# Altium schematic sheet Models.SchDoc
size A3
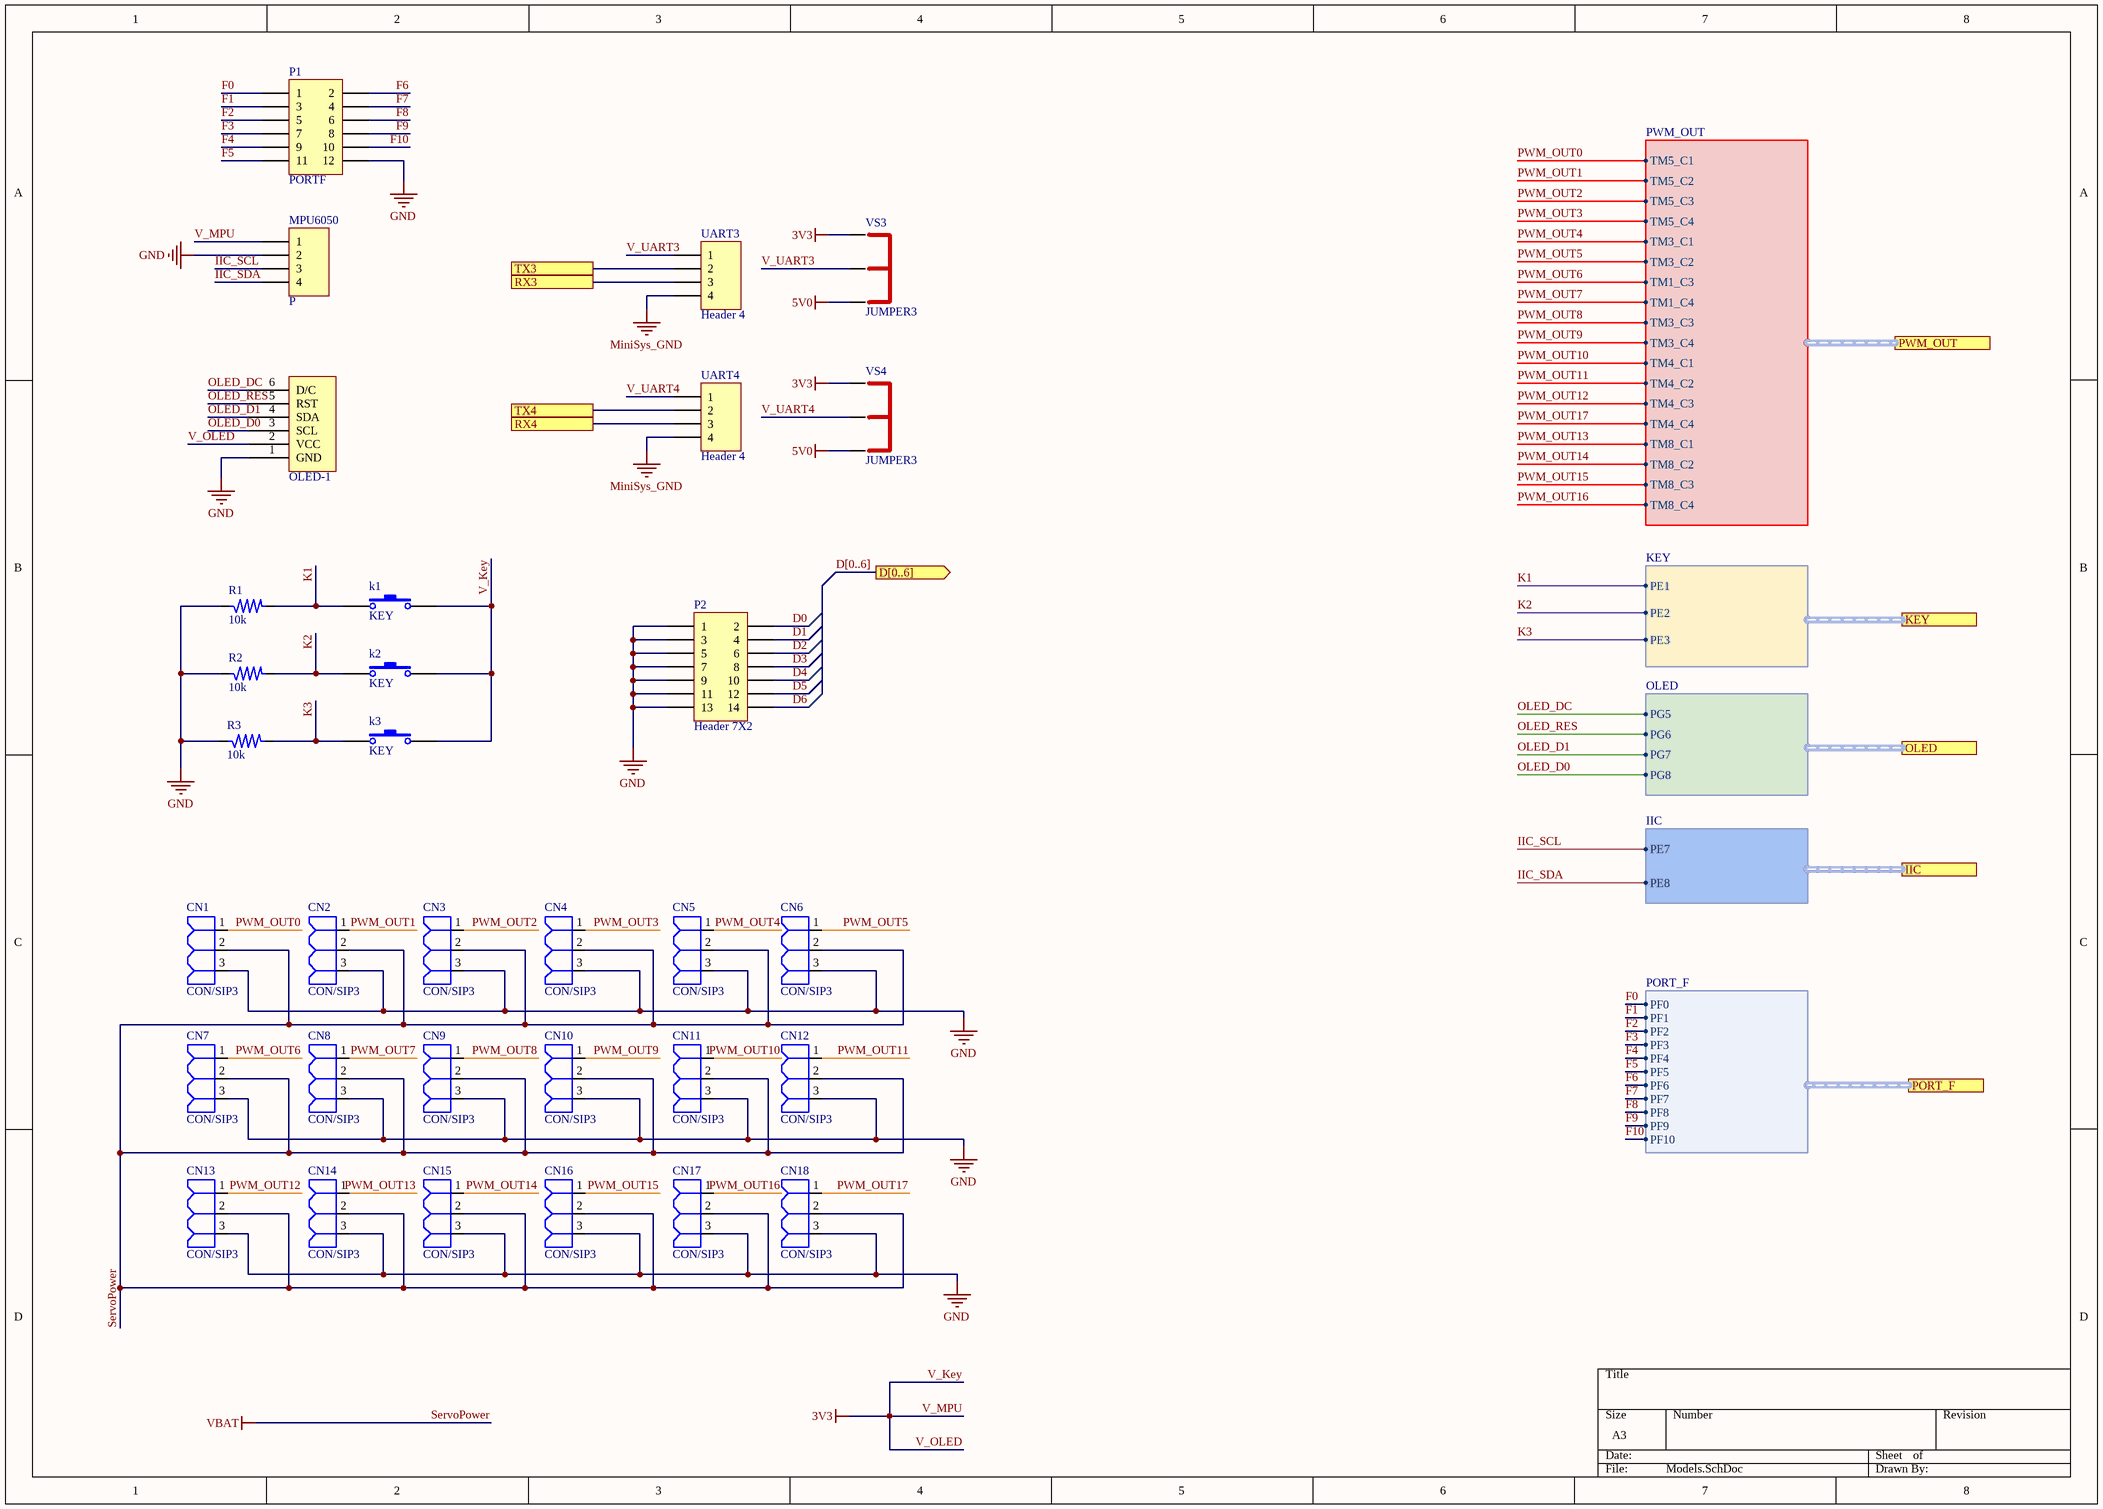
[diagram p0: Models.SchDoc]

## Parts
CN1  CON/SIP3  [HDR1X3]
CN2  CON/SIP3  [HDR1X3]
CN3  CON/SIP3  [HDR1X3]
CN4  CON/SIP3  [HDR1X3]
CN5  CON/SIP3  [HDR1X3]
CN6  CON/SIP3  [HDR1X3]
CN7  CON/SIP3  [HDR1X3]
CN8  CON/SIP3  [HDR1X3]
CN9  CON/SIP3  [HDR1X3]
CN10  CON/SIP3  [HDR1X3]
CN11  CON/SIP3  [HDR1X3]
CN12  CON/SIP3  [HDR1X3]
CN13  CON/SIP3  [HDR1X3]
CN14  CON/SIP3  [HDR1X3]
CN15  CON/SIP3  [HDR1X3]
CN16  CON/SIP3  [HDR1X3]
CN17  CON/SIP3  [HDR1X3]
CN18  CON/SIP3  [HDR1X3]
k1  KEY  [按键-贴片-1]
k2  KEY  [按键-贴片-1]
k3  KEY  [按键-贴片-1]
MPU6050  P  [HDR1X4]
OLED-1  OLED直插  [OLED直插]  (value not drawn)
P1  PORTF  [HDR2X6]
P2  Header 7X2  [HDR2X7]
R1  10k  [R0805]
R2  10k  [R0805]
R3  10k  [R0805]
UART3  Header 4  [HDR1X4]
UART4  Header 4  [HDR1X4]
VS3  JUMPER3  [Jumper3]
VS4  JUMPER3  [Jumper3]

## Ports
D[0..6] (out), IIC (harness IIC), KEY (harness KEY), OLED (harness OLED), PORT_F (harness PORT_F), PWM_OUT (harness PWM_OUT), RX3, RX4, TX3, TX4

## Harnesses
PWM_OUT: TM5_C1, TM5_C2, TM5_C3, TM5_C4, TM3_C1, TM3_C2, TM1_C3, TM1_C4, TM3_C3, TM3_C4, TM4_C1, TM4_C2, TM4_C3, TM8_C1, TM8_C2, TM8_C3, TM8_C4, TM4_C4
KEY: PE1, PE2, PE3
OLED: PG5, PG6, PG7, PG8
IIC: PE7, PE8
PORT_F: PF0, PF1, PF2, PF3, PF4, PF5, PF6, PF7, PF8, PF9, PF10

## Nets
5V0: VS3.3 VS4.3
GND: CN1.3 CN2.3 CN3.3 CN4.3 CN5.3 CN6.3 CN7.3 CN8.3 CN9.3 CN10.3 CN11.3 CN12.3 CN13.3 CN14.3 CN15.3 CN16.3 CN17.3 CN18.3 MPU6050.2 OLED-1.1(GND) P1.12 P2.1 P2.3 P2.5 P2.7 P2.9 P2.11 P2.13 R1.2 R2.2 R3.2
MiniSys_GND: UART3.4 UART4.4
ServoPower: CN1.2 CN2.2 CN3.2 CN4.2 CN5.2 CN6.2 CN7.2 CN8.2 CN9.2 CN10.2 CN11.2 CN12.2 CN13.2 CN14.2 CN15.2 CN16.2 CN17.2 CN18.2  [also labelled VBAT]
V_Key: k1.2 k2.2 k3.2 MPU6050.1 OLED-1.2(VCC) VS3.1 VS4.1  [also labelled 3V3, V_MPU, V_OLED]
D0: P2.2
D1: P2.4
D2: P2.6
D3: P2.8
D4: P2.10
D5: P2.12
D6: P2.14
F0: P1.1 ; port PORT_F.PF0
F1: P1.3 ; port PORT_F.PF1
F2: P1.5 ; port PORT_F.PF2
F3: P1.7 ; port PORT_F.PF3
F4: P1.9 ; port PORT_F.PF4
F5: P1.11 ; port PORT_F.PF5
F6: P1.2 ; port PORT_F.PF6
F7: P1.4 ; port PORT_F.PF7
F8: P1.6 ; port PORT_F.PF8
F9: P1.8 ; port PORT_F.PF9
F10: P1.10 ; port PORT_F.PF10
IIC_SCL: MPU6050.3 ; port IIC.PE7
IIC_SDA: MPU6050.4 ; port IIC.PE8
K1: k1.1 R1.1 ; port KEY.PE1
K2: k2.1 R2.1 ; port KEY.PE2
K3: k3.1 R3.1 ; port KEY.PE3
OLED_D0: OLED-1.3(SCL) ; port OLED.PG8
OLED_D1: OLED-1.4(SDA) ; port OLED.PG7
OLED_DC: OLED-1.6(D/C) ; port OLED.PG5
OLED_RES: OLED-1.5(RST) ; port OLED.PG6
PWM_OUT0: CN1.1 ; port PWM_OUT.TM5_C1
PWM_OUT1: CN2.1 ; port PWM_OUT.TM5_C2
PWM_OUT2: CN3.1 ; port PWM_OUT.TM5_C3
PWM_OUT3: CN4.1 ; port PWM_OUT.TM5_C4
PWM_OUT4: CN5.1 ; port PWM_OUT.TM3_C1
PWM_OUT5: CN6.1 ; port PWM_OUT.TM3_C2
PWM_OUT6: CN7.1 ; port PWM_OUT.TM1_C3
PWM_OUT7: CN8.1 ; port PWM_OUT.TM1_C4
PWM_OUT8: CN9.1 ; port PWM_OUT.TM3_C3
PWM_OUT9: CN10.1 ; port PWM_OUT.TM3_C4
PWM_OUT10: CN11.1 ; port PWM_OUT.TM4_C1
PWM_OUT11: CN12.1 ; port PWM_OUT.TM4_C2
PWM_OUT12: CN13.1 ; port PWM_OUT.TM4_C3
PWM_OUT13: CN14.1 ; port PWM_OUT.TM8_C1
PWM_OUT14: CN15.1 ; port PWM_OUT.TM8_C2
PWM_OUT15: CN16.1 ; port PWM_OUT.TM8_C3
PWM_OUT16: CN17.1 ; port PWM_OUT.TM8_C4
PWM_OUT17: CN18.1 ; port PWM_OUT.TM4_C4
RX3: UART3.3 ; port RX3
RX4: UART4.3 ; port RX4
TX3: UART3.2 ; port TX3
TX4: UART4.2 ; port TX4
V_UART3: UART3.1 VS3.2
V_UART4: UART4.1 VS4.2

## Buses and harness runs
bus D[0..6] = port D[0..6]

## Library data of the parts
k1-k3 = 按键
MPU6050 UART3 UART4 = Header 4: Header, 4-Pin; LatestRevisionDate: 17-Jul-2002; LatestRevisionNote: Re-released for DXP Platform.; Publisher: Altium Limited
P1 = Header 6X2: Header, 6-Pin, Dual row; LatestRevisionDate: 17-Jul-2002; LatestRevisionNote: Re-released for DXP Platform.; Publisher: Altium Limited
P2 = Header 7X2: Header, 7-Pin, Dual row; LatestRevisionDate: 17-Jul-2002; LatestRevisionNote: Re-released for DXP Platform.; Publisher: Altium Limited
R1-R3 = Resistor: 电阻
VS3 VS4 = JUMPER3: Jumper